# EAGLE schematic tft-18-sd (EAGLE 7.6.0)
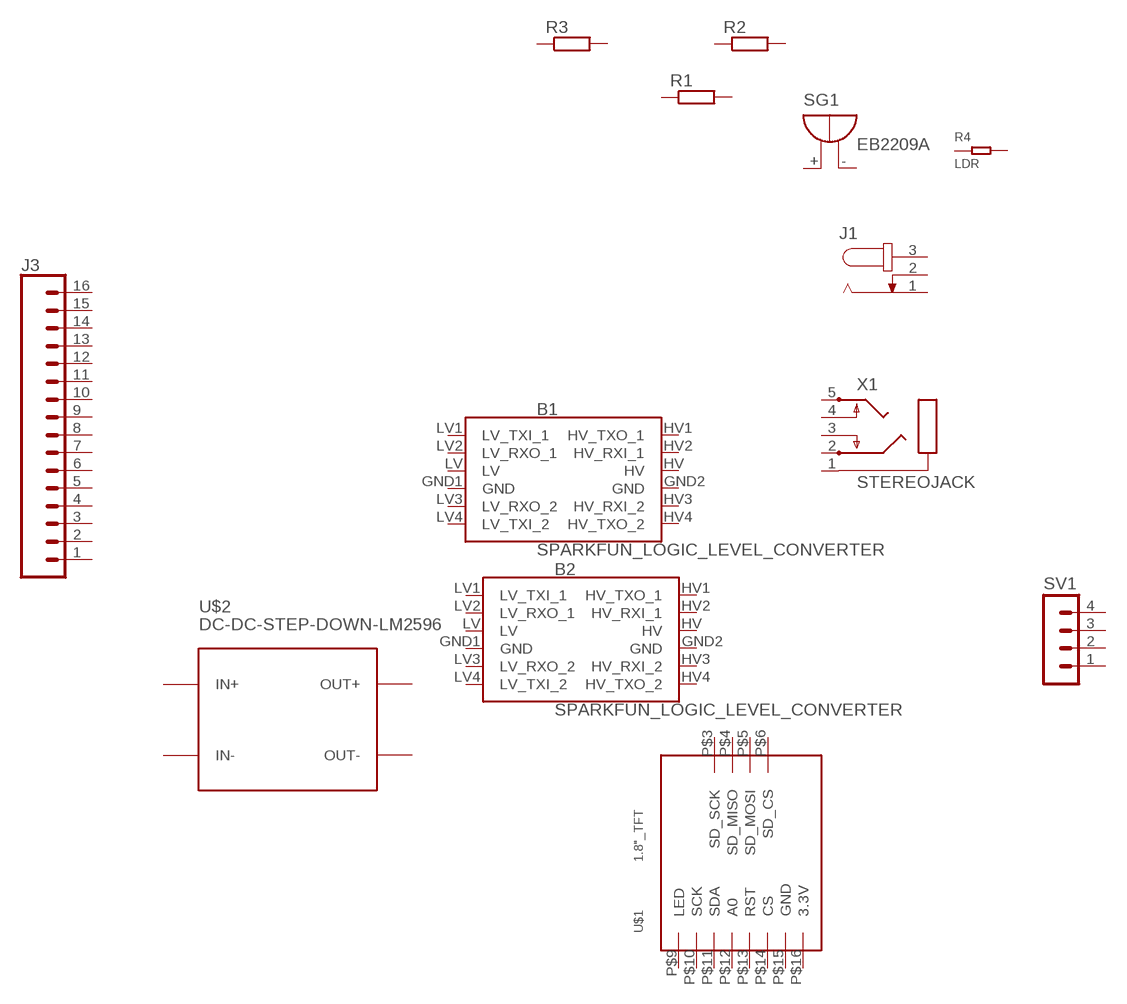
[diagram p0: schematic, sheet 1]

## Parts
B1  SPARKFUN_LOGIC_LEVEL_CONVERTER  [SPARKFUN_LOGIC_LEVEL_CONVERTER]
B2  SPARKFUN_LOGIC_LEVEL_CONVERTER  [SPARKFUN_LOGIC_LEVEL_CONVERTER]
J1  JACK-PLUG0  [SPC4077]
J3  CONN_16  [1X16]
R1  R-EU_0207/5V  [0207/5V]
R2  R-EU_0207/5V  [0207/5V]
R3  R-EU_0207/5V  [0207/5V]
R4  LDR  DIP-RES-LDR(2P-D2.3X3.7MM)  [PR-2.8-4.2X4.9MM]
SG1  EB2209A  [EB2209A]
SV1  MA04-1  [MA04-1]
U$1  1.8"_TFT  [1.8"_TFT]
U$2  DC-DC-STEP-DOWN-LM2596  [DC-DC-STEP-DOWN-LM2596]
X1  STEREOJACK  [STX3100]
Unconnected: B1.HV1(HV_TXO_1) B1.HV2(HV_RXI_1) B1.HV3(HV_RXI_2) B1.HV4(HV_TXO_2) B1.LV1(LV_TXI_1) B1.LV2(LV_RXO_1) B1.LV3(LV_RXO_2) B1.LV4(LV_TXI_2) B2.HV1(HV_TXO_1) B2.HV2(HV_RXI_1) B2.HV3(HV_RXI_2) B2.HV4(HV_TXO_2) B2.LV1(LV_TXI_1) B2.LV2(LV_RXO_1) B2.LV3(LV_RXO_2) B2.LV4(LV_TXI_2) J1.1 J1.2 J1.3 J3.1 J3.2 J3.3 J3.4 J3.5 J3.6 J3.7 J3.8 J3.9 J3.10 J3.11 J3.12 J3.13 J3.14 J3.15 J3.16 R1.1 R1.2 R2.1 R2.2 R3.1 R3.2 R4.1 R4.2 SG1.+ SG1.- SV1.1 SV1.2 SV1.3 SV1.4 U$1.P$3(SD_SCK) U$1.P$4(SD_MISO) U$1.P$5(SD_MOSI) U$1.P$6(SD_CS) U$1.P$9(LED) U$1.P$10(SCK) U$1.P$11(SDA) U$1.P$12(A0) U$1.P$13(RST) U$1.P$14(CS) U$1.P$15(GND) U$1.P$16(3.3V) U$2.IN+ U$2.IN- U$2.OUT+ U$2.OUT- X1.1 X1.2 X1.3 X1.4 X1.5

## Power pins joined to a net without a drawn wire
GND: B1.GND1(GND) B1.GND2(GND) B2.GND1(GND) B2.GND2(GND)
HV: B1.HV B2.HV
LV: B1.LV B2.LV

## Library data of the parts
B1 B2 = SparkFun-Boards:SPARKFUN_LOGIC_LEVEL_CONVERTER: SparkFun Logic Level Converter -Bi-Directional This is the mechnical outline for the 3.3V - 5V bi directional logic level converter. *Note, the "LOCK" Package has the header pins staggered by an offset of 5 mils (off center line), so that when you slide a row of standard 0.1" headers into the PTH pads, it will hold position vertically. See the follwing turorial for more information on this type of special footprints: Sneaky Footprints <https://www.sparkfun.com/tutorials/114> SparkFun Products: SparkFun Logic Level Converter - Bi-Directional <https://www.sparkfun.com/products/12009>
J1 = con-jack:JACK-PLUG: DC POWER JACK Power Jack, DC, Right Angle, Through Hole, Rated 5A at 16VDC, PC Terminals Distributor: Farnell (www.Farnell.de) Drawing: 84N1161.pdf / 84N1162.pdf Manufacturer: SPC Technology (www.spctechnology.com) Type: SPC4077 / SPC 4078; OC_FARNELL: unknown; OC_NEWARK: unknown
J3 = SparkFun-Connectors:CONN_16: Multi connection point. Often used as Generic Header-pin footprint for 0.1 inch spaced/style header connections On any of the 0.1 inch spaced packages, you can populate with these: Break Away Headers - Straight <https://www.sparkfun.com/products/116> (PRT-00116) Break Away Male Headers - Right Angle <https://www.sparkfun.com/products/553> (PRT-00553) Female Headers <https://www.sparkfun.com/products/115> (PRT-00115) Break Away Headers - Machine Pin <https://www.sparkfun.com/products/117> (PRT-00117) Break Away Female Headers - Swiss Machine Pin <https://www.sparkfun.com/products/743> (PRT-00743) For SCREWTERMINALS and SPRING TERMINALS visit here: Screw Terimnals on SparkFun.com <https://www.sparkfun.com/search/results?term=Screw+Terminals> (5mm/3.5mm/2.54mm spacing) This device is also useful as a general connection point to wire up your design to another part of your project. Our various solder wires solder well into these plated through hole pads. Hook-Up Wire - Assortment (Stranded, 22 AWG) <https://www.sparkfun.com/products/11375> (PRT-11375) Hook-Up Wire - Assortment (Solid Core, 22 AWG) <https://www.sparkfun.com/products/11367> (PRT-11367) View the entire wire category on our website here <https://www.sparkfun.com/categories/141> Special notes: Molex polarized connector foot print use with SKU : PRT-08231 with associated crimp pins and housings. 1MM SMD Version SKU: PRT-10208 NOTES ON THE VARIANTS LOCK and LOCK_LONGPADS... This footprint was designed to help hold the alignment of a through-hole component (i.e. 6-pin header) while soldering it into place. You may notice that each hole has been shifted either up or down by 0.005 of an inch from it's more standard position (which is a perfectly straight line). This slight alteration caused the pins (the squares in the middle) to touch the edges of the holes. Because they are alternating, it causes a "brace" to hold the component in place. 0.005 has proven to be the perfect amount of "off-center" position when using our standard breakaway headers. Although looks a little odd when you look at the bare footprint, once you have a header in there, the alteration is very hard to notice. Also,if you push a header all the way into place, it is covered up entirely on the bottom side.
R1-R3 = resistor:R-EU_: RESISTOR, European symbol
R4 = Seeed-OPL-Resistor:DIP-RES-LDR(2P-D2.3X3.7MM): 314120003; MPN: LDR-VT90N2
SG1 = buzzer:EB2209A: BUZZER Source: Buerklin; OC_FARNELL: unknown; OC_NEWARK: unknown
SV1 = con-lstb:MA04-1: PIN HEADER; OC_FARNELL: unknown; OC_NEWARK: unknown
U$1 = tft_1_8_1_44_oled_0_96:1.8"_TFT
U$2 = diy-modules:DC-DC-STEP-DOWN-LM2596: DC/DC Step-Down Regulator based on LM2596-ADJ chip
X1 = adafruit:STEREOJACK: MIC/HEADPHONE JACK Stereo jack with two switches. Kycon STX3100, CUI SJ1-3555NG and/or 4UCon 05544